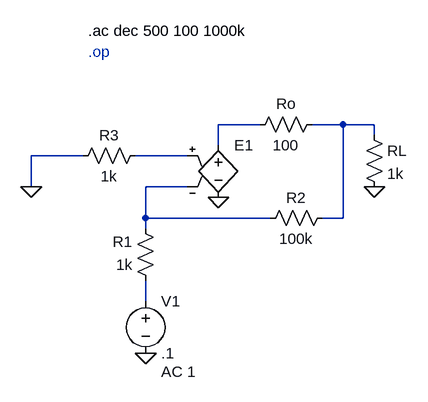
[diagram p0: schematic Transferencia2.asc]
Transferencia2.asc, the LTspice schematic file:
Version 4
SHEET 1 880 680
WIRE 304 112 240 112
WIRE 432 112 384 112
WIRE 480 112 432 112
WIRE 480 128 480 112
WIRE 240 144 240 112
WIRE 32 160 -48 160
WIRE 192 160 112 160
WIRE -48 208 -48 160
WIRE 192 208 128 208
WIRE 128 256 128 208
WIRE 320 256 128 256
WIRE 432 256 432 112
WIRE 432 256 400 256
WIRE 128 272 128 256
WIRE 128 384 128 352
FLAG 240 224 0
FLAG 480 208 0
FLAG 128 464 0
FLAG -48 208 0
DATAFLAG 464 112 ""
SYMBOL e 240 128 R0
WINDOW 3 24 96 Invisible 2
SYMATTR InstName E1
SYMATTR Value 1000/(1+s/62831.8)
SYMATTR SpiceModel laplace
SYMBOL res 400 96 R90
WINDOW 0 0 56 VBottom 2
WINDOW 3 32 56 VTop 2
SYMATTR InstName Ro
SYMATTR Value 100
SYMBOL res 464 112 R0
SYMATTR InstName RL
SYMATTR Value 1k
SYMBOL res 144 368 R180
WINDOW 0 36 76 Left 2
WINDOW 3 36 40 Left 2
SYMATTR InstName R1
SYMATTR Value 1k
SYMBOL res 416 240 R90
WINDOW 0 0 56 VBottom 2
WINDOW 3 32 56 VTop 2
SYMATTR InstName R2
SYMATTR Value 100k
SYMBOL res 128 144 R90
WINDOW 0 0 56 VBottom 2
WINDOW 3 32 56 VTop 2
SYMATTR InstName R3
SYMATTR Value 1k
SYMBOL voltage 128 368 R0
WINDOW 123 24 124 Left 2
WINDOW 39 0 0 Left 0
SYMATTR InstName V1
SYMATTR Value .1
SYMATTR Value2 AC 1
TEXT 40 0 Left 2 ;.op
TEXT 40 -32 Left 2 !.ac dec 500 100 1000k

The netlist it stands for:
* Transferencia2.asc
E1 N001 0 N003 N004 laplace 1000/(1+s/62831.8)
Ro N002 N001 100
RL N002 0 1k
R1 N005 N004 1k
R2 N002 N004 100k
R3 N003 0 1k
V1 N005 0 .1 AC 1
* .op
.ac dec 500 100 1000k
.backanno
.end